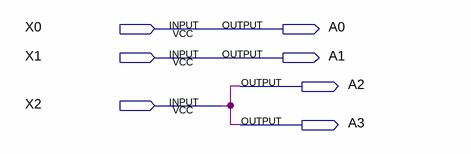
[diagram p0: schematic sheet]
// Quartus schematic Codificador_Niveis.bdf as structural Verilog: 0 symbols, 7 pins
module Codificador_Niveis (
  input  X0,
  input  X1,
  input  X2,
  output A0,
  output A1,
  output A2,
  output A3
);


  assign A0 = X0;
  assign A1 = X1;
  assign A2 = X2;
  assign A3 = X2;
endmodule
